# Altium schematic sheet TTAmp_3T0K_amp_tensometer_3.SchDoc
size A4; ApprovedBy: Krzysztof Belewicz; CheckedBy: Krzysztof Belewicz; Author: Krzysztof Belewicz; CompanyName: Koło Naukowe Systemów Scalonych; DrawnBy: Krzysztof Belewicz; Organization: KNSS; Address1: Koło Naukowe; Address2: Systemów Scalonych; Address3: 00-665 Warszawa; Address4: Nowowiejska 15/19; Revision: 0.1; SheetNumber: 4; SheetTotal: 5
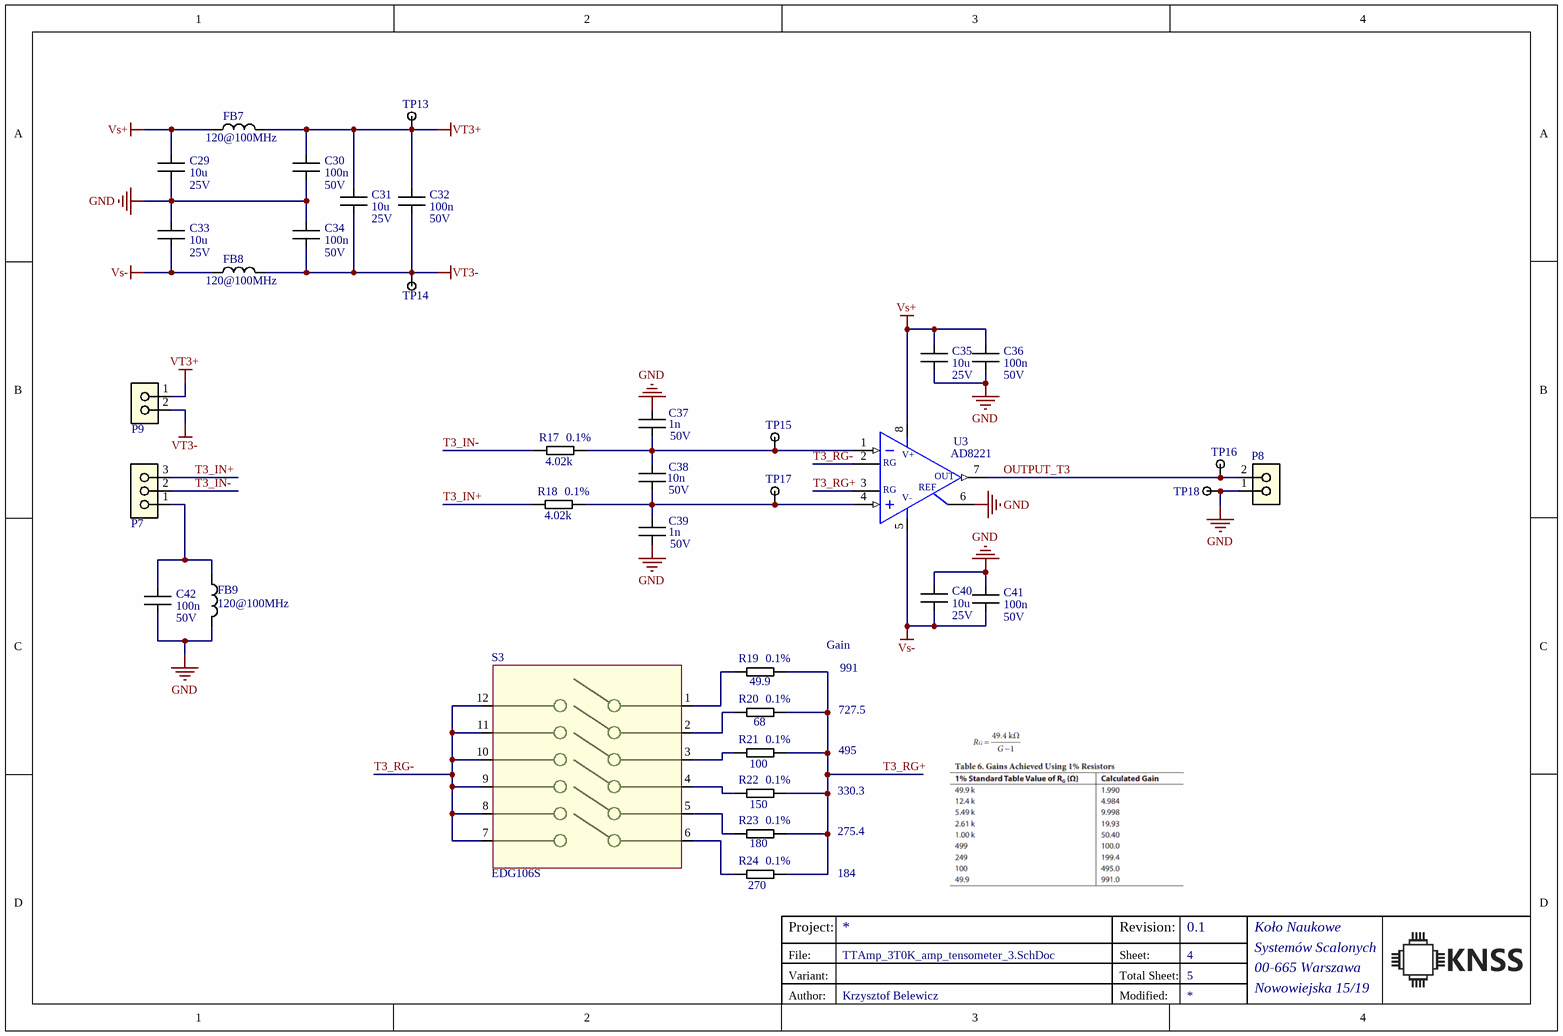
[diagram p0: TTAmp_3T0K_amp_tensometer_3.SchDoc]

## Parts
C29  value 10u  MaxVoltage: 25V  [CAPC2012N]  (hidden comment: Capacitor)
C30  value 100n  MaxVoltage: 50V  [CAPC1608N]  (hidden comment: Capacitor)
C31  value 10u  MaxVoltage: 25V  [CAPC2012N]  (hidden comment: Capacitor)
C32  value 100n  MaxVoltage: 50V  [CAPC1608N]  (hidden comment: Capacitor)
C33  value 10u  MaxVoltage: 25V  [CAPC2012N]  (hidden comment: Capacitor)
C34  value 100n  MaxVoltage: 50V  [CAPC1608N]  (hidden comment: Capacitor)
C35  value 10u  MaxVoltage: 25V  [CAPC2012N]  (hidden comment: Capacitor)
C36  value 100n  MaxVoltage: 50V  [CAPC1608N]  (hidden comment: Capacitor)
C37  value 1n  MaxVoltage: 50V  [CAPC1608N]  (hidden comment: Capacitor)
C38  value 10n  MaxVoltage: 50V  [CAPC1608N]  (hidden comment: Capacitor)
C39  value 1n  MaxVoltage: 50V  [CAPC1608N]  (hidden comment: Capacitor)
C40  value 10u  MaxVoltage: 25V  [CAPC2012N]  (hidden comment: Capacitor)
C41  value 100n  MaxVoltage: 50V  [CAPC1608N]  (hidden comment: Capacitor)
C42  value 100n  MaxVoltage: 50V  [CAPC1608N]  (hidden comment: Capacitor)
FB7  value 120@100MHz  [INDC1608N]  (hidden comment: Ferrite Bead)
FB8  value 120@100MHz  [INDC1608N]  (hidden comment: Ferrite Bead)
FB9  value 120@100MHz  [INDC1608N]  (hidden comment: Ferrite Bead)
P7  AK100/3DS-5,0-V/GRAU  [AK100/3DS-5,0-V/GRAU]  (value not drawn)
P8  AK100/2DS-5,0-V/GRAU  [AK100/2DS-5,0-V/GRAU]  (value not drawn)
P9  AK100/2DS-5,0-V/GRAU  [AK100/2DS-5,0-V/GRAU]  (value not drawn)
R17  value 4.02k  Tolerance: 0.1%  [RESC1608N]  (hidden comment: Resistor)
R18  value 4.02k  Tolerance: 0.1%  [RESC1608N]  (hidden comment: Resistor)
R19  value 49.9  Tolerance: 0.1%  [RESC1608N]  (hidden comment: Resistor)
R20  value 68  Tolerance: 0.1%  [RESC1608N]  (hidden comment: Resistor)
R21  value 100  Tolerance: 0.1%  [RESC1608N]  (hidden comment: Resistor)
R22  value 150  Tolerance: 0.1%  [RESC1608N]  (hidden comment: Resistor)
R23  value 180  Tolerance: 0.1%  [RESC1608N]  (hidden comment: Resistor)
R24  value 270  Tolerance: 0.1%  [RESC1608N]  (hidden comment: Resistor)
S3  EDG106S  [EDG106S]
TP13  (no value)  [TP-SMD-1.0MM]  (no BOM)
TP14  (no value)  [TP-SMD-1.0MM]  (no BOM)
TP15  (no value)  [TP-SMD-1.0MM]  (no BOM)
TP16  (no value)  [TP-SMD-1.0MM]  (no BOM)
TP17  (no value)  [TP-SMD-1.0MM]  (no BOM)
TP18  (no value)  [TP-SMD-1.0MM]  (no BOM)
U3  AD8221  [R-8_N]

## Nets
GND: C29.1 C30.1 C33.2 C34.2 C35.1 C36.1 C37.2 C39.1 C40.2 C41.2 C42.1 FB9.2 P8.1 TP18.1 U3.6(REF)
Vs+: C29.2 C35.2 C36.2 FB7.2 U3.8(V+)
Vs-: C33.1 C40.1 C41.1 FB8.2 U3.5(V-)
VT3+: C30.2 C31.2 C32.2 FB7.1 P9.1 TP13.1
VT3-: C31.1 C32.1 C34.1 FB8.1 P9.2 TP14.1
OUTPUT_T3: P8.2 TP16.1 U3.7(OUT)
T3_IN+: P7.3 R18.2
T3_IN-: P7.2 R17.2
T3_RG+: R19.1 R20.1 R21.1 R22.1 R23.1 R24.1 U3.3(RG)
T3_RG-: S3.7 S3.8 S3.9 S3.10 S3.11 S3.12 U3.2(RG)
NetC37_1: C37.1 C38.2 R17.1 TP15.1 U3.1(-IN)
NetC38_1: C38.1 C39.2 R18.1 TP17.1 U3.4(+IN)
NetC42_2: C42.2 FB9.1 P7.1
NetR19_2: R19.2 S3.1
NetR20_2: R20.2 S3.2
NetR21_2: R21.2 S3.3
NetR22_2: R22.2 S3.4
NetR23_2: R23.2 S3.5
NetR24_2: R24.2 S3.6

## Notes on the sheet
- Gain
- 727.5
- 991
- 495
- 330.3
- 275.4
- 184
- Project:
- Variant:
- File:
- Sheet:
- Revision:
- Total Sheet:
- Author:
- Modified:

## Library data of the parts
C29-C37 C39-C42 = Capacitor: Tolerance: 10%; Supplier 1: TME; Supplier 2: *
  C29 C31 C33 C35 C40: Supplier Part Number 1: GRM21BR61E106KA73L
  C30 C32 C34 C36 C41 C42: Supplier Part Number 1: CL10B104KB8NNNC
  C37 C39: Supplier Part Number 1: VJ0603Y102KXACW1BC
C38 = Capacitor: Tolerance: 20%; Supplier 1: TME; Supplier 2: *; Supplier Part Number 1: VJ0603Y103MXACW1BC
FB7-FB9 = Inductor: Max Current: 3A; Tolerance: *; Supplier 1: TME; Supplier 2: *; Supplier Part Number 1: BLM18KG121TN1D
P7 = AK100/3DS-5,0-V/GRAU: Listwa zaciskowa do druku; kątowe 90°; 5mm; tory:3; na PCB; 24A; Manufacturer: PTR MESSTECHNIK; Supplier Part Number 1: TB-5.0-P-3P-12; Supplier 1: TME; Manufacturer Part Number: AK100/3DS-5,0-V/GRAU
P8 P9 = AK100/2DS-5,0-V/GRAU: Listwa zaciskowa do druku; kątowe 90°; 5mm; tory:2; na PCB; 24A; Manufacturer: PTR MESSTECHNIK; Supplier Part Number 1: TB-5.0-P-2P-12; Supplier 1: TME; Manufacturer Part Number: AK100/2DS-5,0-V/GRAU
R17 R18 = Resistor: Manufacturer Part Number 1: AR03BTCX4021; Manufacturer 1: VIKING; Power: 0.1W; Supplier 1: TME; Supplier Part Number 1: AR0603-4K02-0.1%
R19 = Resistor: Manufacturer 1: VIKING; Manufacturer Part Number 1: AR03BTCX49R9; Power: 0.1W; Supplier 1: TME; Supplier Part Number 1: AR0603-49R9-0.1%
R20 = Resistor: Manufacturer Part Number 1: AR03BTCX0680; Manufacturer: VIKING; Power: 0.1W; Supplier 1: TME; Supplier Part Number 1: AR0603-68R-0.1%
R21 = Resistor: Manufacturer Part Number 1: AR03BTCX1000; Manufacturer 1: VIKING; Power: 0.1W; Supplier 1: TME; Supplier Part Number 1: AR0603-100R-0.1%
R22 = Resistor: Manufacturer Part Number 1: AR03BTCX1500; Manufacturer 1: VIKING; Power: 0.1W; Supplier 1: TME; Supplier Part Number 1: AR0603-150R-0.1%
R23 = Resistor: Manufacturer Part Number 1: AR03BTCX1800; Manufacturer 1: VIKING; Power: 0.1W; Supplier 1: TME; Supplier Part Number 1: AR0603-180R-0.1%
R24 = Resistor: Manufacturer Part Number 1: AR03BTCX2700; Manufacturer 1: VIKING; Power: 0.1W; Supplier 1: TME; Supplier Part Number 1: AR0603-180R-0.1%
S3 = EDG106S: Przełącznik: DIP-SWITCH; Ilość sekcji:6; ON-OFF; 0,1A/24VDC; 500V; Manufacturer 1: ECE; Manufacturer Part Number 1: EDG106S; Supplier 1: TME; Supplier Part Number 1: EDG106S
TP13-TP18 = TP1: Test Point for probe
U3 = AD8221: Precision Instrumentation Amplifier; Manufacturer Part Number 1: AD8221BRZ; Manufacturer 1: ANALOG DEVICES; PackageReference 1: SOIC_N; ComponentLink1Description: Manufacturer Link; ComponentLink1URL: http://www.analog.com/en/prod/0%2C2877%2CAD622%2C00.html; ComponentLink2Description: Datasheet; ComponentLink2URL: http://www.analog.com/UploadedFiles/Data_Sheets/218546992AD622_c.pdf; Supplier 1: TME; Supplier Part Number 1: AD8221BRZ